# Altium project HFAC_Stimulator_4channel.PrjPCB (part 1 of 2)
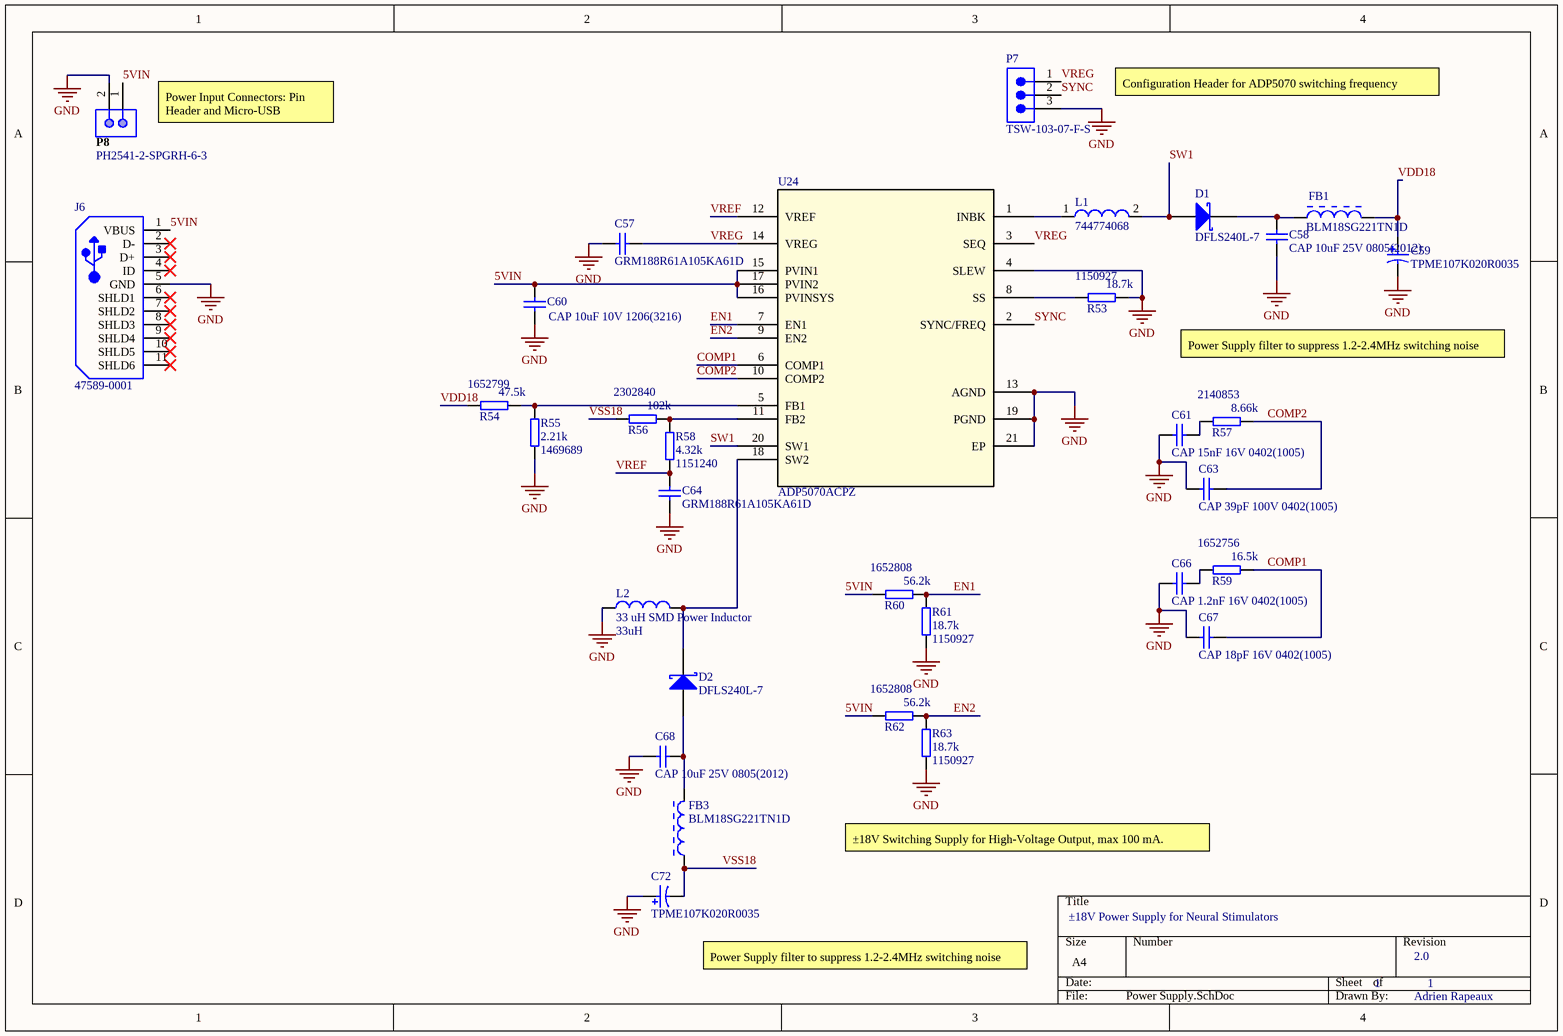
[diagram p0: Power Supply.SchDoc]
11 sheets, 198 parts. Net scope: global (net labels, ports and power ports of the same name join across sheets).
Board files: HFAC_Stimulator_4channel.PcbDoc, HFAC_Stimulator_4channel_panel.PcbDoc
Sheets:
  Power Supply.SchDoc
  Digital Interfaces.SchDoc
  Howland Channel 1.SchDoc
  Howland Channel 2.SchDoc
  Howland Channel 3.SchDoc
  Howland Channel 4.SchDoc
  Freedom Board Interface.SchDoc
  Isolated MCU Power Supply.SchDoc
  Low-Voltage Power Supply.SchDoc
  Electrode Monitor Channel.SchDoc
  N17V5 Reference.SchDoc

## Sheet Power Supply.SchDoc
size A4

### Parts
C57  GRM188R61A105KA61D  [CAPC1608X90X35LL10T15]
C58  CAP 10uF 25V 0805(2012)  [CAPC0805(2012)145_N]
C59  TPME107K020R0035  [CAPMP7344X31-T_V]
C60  CAP 10uF 10V 1206(3216)  [CAPC1206(3216)130_L]
C61  CAP 15nF 16V 0402(1005)  [CAPC0402(1005)60_L]
C63  CAP 39pF 100V 0402(1005)  [CAPC0402(1005)60_L]
C64  GRM188R61A105KA61D  [CAPC1608X90X35LL10T15]
C66  CAP 1.2nF 16V 0402(1005)  [CAPC0402(1005)60_L]
C67  CAP 18pF 16V 0402(1005)  [CAPC0402(1005)60_L]
C68  CAP 10uF 25V 0805(2012)  [CAPC0805(2012)145_N]
C72  TPME107K020R0035  [CAPMP7344X31-T_V]
D1  DFLS240L-7  [DIOD-POWERDI123-2_A_V]
D2  DFLS240L-7  [DIOD-POWERDI123-2_A_V]
FB1  BLM18SG221TN1D  [MURA-BLM18SG-B25-CHIP-2_V1]
FB3  BLM18SG221TN1D  [MURA-BLM18SG-B25-CHIP-2_V1]
J6  47589-0001  [MOLX-47589-0001_V]
L1  744774068  [WE-PD2-M]
L2  33 uH SMD Power Inductor  value 33uH  [LPS6235 SERIES]
P7  TSW-103-07-F-S  [SMTC-TSW-103-07-X-S]
P8  PH2541-2-SPGRH-6-3  [PH2541-2-SPGRH-6-3_V]
R53  18.7k  Supplier Part Number 2: 1150927  [RESC0402]
R54  47.5k  Supplier Part Number 2: 1652799  [RESC0402]
R55  2.21k  Supplier Part Number 1: 1469689  [RESC0402]
R56  102k  Supplier Part Number 1: 2302840  [RESC0402]
R57  8.66k  Supplier Part Number 1: 2140853  [RESC0402]
R58  4.32k  Supplier Part Number 1: 1151240  [RESC0402]
R59  16.5k  Supplier Part Number 1: 1652756  [RESC0402]
R60  56.2k  Supplier Part Number 1: 1652808  [RESC0402]
R61  18.7k  Supplier Part Number 2: 1150927  [RESC0402]
R62  56.2k  Supplier Part Number 1: 1652808  [RESC0402]
R63  18.7k  Supplier Part Number 2: 1150927  [RESC0402]
U24  ADP5070ACPZ  [CP_20_8]

### Nets
GND: C57.1 C58.1 C59.2 C60.1 C61.1 C63.1 C64.1 C66.1 C67.1 C68.1 C72.1 J6.5(GND) L2.1 P7.3 P8.2 R53.1 R55.2 R61.2 R63.2 U24.4(SLEW) U24.13(AGND) U24.19(PGND) U24.21(EP)
5VIN: C60.2 J6.1(VBUS) P8.1 R60.2 R62.2 U24.15(PVIN1) U24.16(PVINSYS) U24.17(PVIN2)
COMP1: C67.2 R59.1 U24.6(COMP1)
COMP2: C63.2 R57.1 U24.10(COMP2)
EN1: R60.1 R61.1 U24.7(EN1)
EN2: R62.1 R63.1 U24.9(EN2)
SW1: D1.1(A) L1.2 U24.20(SW1)
SYNC: P7.2 U24.2(SYNC/FREQ)
VDD18: C59.1 FB1.2 R54.2
VREF: C64.2 R58.2 U24.12(VREF)
VREG: C57.2 P7.1 U24.3(SEQ) U24.14(VREG)
VSS18: C72.2 FB3.1 R56.2
NetC58_2: C58.2 D1.2(K) FB1.1
NetC61_2: C61.2 R57.2
NetC66_2: C66.2 R59.2
NetC68_2: C68.2 D2.1(A) FB3.2
NetD2_2: D2.2(K) L2.2 U24.18(SW2)
NetL1_1: L1.1 U24.1(INBK)
NetR53_2: R53.2 U24.8(SS)
NetR54_1: R54.1 R55.1 U24.5(FB1)
NetR56_1: R56.1 R58.1 U24.11(FB2)

Not connected (* = marked no-connect by the designer): J6 2(D-)* 3(D+)* 4(ID)* 6(SHLD1)* 7(SHLD2)* 8(SHLD3)* 9(SHLD4)* 10(SHLD5)* 11(SHLD6)*

### Notes on the sheet
- Configuration Header for ADP5070 switching frequency
- (near P8) Power Input Connectors: Pin Header and Micro-USB
- Power Supply filter to suppress 1.2-2.4MHz switching noise
- ±18V Switching Supply for High-Voltage Output, max 100 mA.
- ±18V Power Supply for Neural Stimulators
- 1
- 2.0
- Adrien Rapeaux

### Library data of the parts
C57 C64 = CMP-2000-06336-1: Chip Capacitor, 1 uF, +/- 10%, 10 V, -55 to 85 degC, 0603 (1608 Metric), RoHS, Tape and Reel; Manufacturer: Murata; Dielectric: X5R; Voltage Rating: 10V; Case Height: 0.8mm; Temperature Coefficient / Code: +/-15%; Type: GeneralPurposeMLCC; Brand: MurataElectronics; Capacitance: 1uF; Case Length: 1.6mm; Capacitance - nF: 1000nF; Package Description: 2-Pin Surface Mount Device, Body 1.6 x 0.8 mm; Maximum Operating Temperature: +85C; Minimum Operating Temperature: -55C; Mounting Technology: SurfaceMount; RoHS: Details; Package Reference: 0603; Product: GeneralTypeMLCCs; Packaging: Reel; Case Code - mm: 1608; Manufacturer URL: http://www.murata.com/; Dimensions: 0.8mmWx1.6mmLx0.8mmH; Factory Pack Quantity: 4000; Case Code - in: 0603; Tolerance: 10%; Product Category: MultilayerCeramicCapacitorsMLCC-SMD/SMT; Series: GRM; Datasheet Version: 02/2016; Case Width: 0.8mm; Operating Temperature Range: -55Cto+85C; Datasheet URL: http://search.murata.co.jp/Ceramy/image/img/A01X/G101/ENG/GRM188R61A105KA61-01.pdf; Package / Case: 0603(1608metric); Termination Style: SMD/SMT; Voltage Rating DC: 10V
C58 C68 = CMP-1036-04932-1: CAP 10uF 25V ±10% 0805 (2012 Metric) Thickness 1.45mm SMD; Case-EIA: 0805; Case-Metric: 2012; Tolerance: Â±10%; Technology: SMT; Value: 10uF; Rated Voltage: 25 V; Max Thickness: 1.45 mm
C59 C72 = CMP-2000-07300-1: Low ESR, 100 uF, 25 V, +/- 10%, -55 to 125 degC, 2-Pin SMD, RoHS, Tape and Reel; Mfr Case Code: DCase; Manufacturer: AVX; ESR: 100mOhms; Unit Weight: 0.023634oz; Capacitance: 100uF; Voltage Rating: 10V; Tolerance: 20%; Leakage Current: 10uA; Ripple Current: 0.49mA; Qualification: Commercial; Dissipation Factor DF: 6; Product: TantalumSolidLowESRStandardGrade; Case Code - mm: 7343; Length: 7.3mm; Datasheet URL: http://datasheets.avx.com/TPS.pdf; Maximum Operating Temperature: +125C; Manufacturer URL: http://www.avx.com/; Package URL: http://www.avx.com/download/software/literature/AVX-Footprint-Library.pdf; Package / Case: 2917(7343metric); Series: TPS; Package Description: 2-Pin Surface Mount Device, Body 7.3 x 4.35 mm; Minimum Operating Temperature: -55C; Mounting Technology: SurfaceMount; Packaging: Reel; Datasheet Version: 01/2017; RoHS: True; Width: 4.3mm; Brand: AVX; Product Category: TantalumCapacitors-SolidSMD; Height: 3.1mm; Termination Style: SMD/SMT; Package Reference: CAPMP7344X31-T; Case Code - in: 2917; Operating Temperature Range: -55Cto+125C
C60 = CMP-1037-04970-1: CAP 10uF 10V -20% to +80% 1206 (3216 Metric) Thickness 1.3mm SMD; Case-Metric: 3216; Case-EIA: 1206; Value: 10uF; Rated Voltage: 10 V; Technology: SMT; Max Thickness: 1.3 mm; Tolerance: -20% to +80%
C61 = CMP-1034-01913-1: CAP 15nF 16V ±10% 0402 (1005 Metric) Thickness 0.6mm SMD; Case-Metric: 1005; Tolerance: Â±10%; Case-EIA: 0402; Value: 15nF; Rated Voltage: 16 V; Technology: SMT; Max Thickness: 0.6 mm
C63 = CMP-1034-01051-1: CAP 39pF 100V ±10% 0402 (1005 Metric) Thickness 0.6mm SMD; Case-Metric: 1005; Case-EIA: 0402; Tolerance: Â±10%; Technology: SMT; Max Thickness: 0.6 mm; Rated Voltage: 100 V; Value: 39pF
C66 = CMP-1034-01647-1: CAP 1.2nF 16V ±10% 0402 (1005 Metric) Thickness 0.6mm SMD; Case-EIA: 0402; Case-Metric: 1005; Tolerance: Â±10%; Value: 1.2nF; Rated Voltage: 16 V; Max Thickness: 0.6 mm; Technology: SMT
C67 = CMP-1034-00853-1: CAP 18pF 16V ±10% 0402 (1005 Metric) Thickness 0.6mm SMD; Case-Metric: 1005; Tolerance: Â±10%; Case-EIA: 0402; Max Thickness: 0.6 mm; Rated Voltage: 16 V; Value: 18pF; Technology: SMT
D1 D2 = CMP-2000-06158-1: Low VF Schottky Barrier Rectifier, 2 A, 40 V, -55 to 125 degC, 2-Pin SMD, RoHS, Tape and Reel; Manufacturer: Diodes Inc; Reverse Voltage-Max [Vrrm]: 40V; Forward Voltage: 0.5V; Average Rectified Current-Max: 2A; Peak Current-Max: 50A; Reverse Current-Max: 100µA; Mounting Technology: SurfaceMount; Package Description: 2-Pin Small Outline Diode, Body 2.8 x 1.78 mm; Manufacturer URL: http://www.diodes.com/; Datasheet URL: http://www.diodes.com/_files/datasheets/ds30516.pdf; Package Reference: POWERDI123-2_A; Datasheet Version: Rev. 8-2, 11/2009
FB1 FB3 = CMP-0686-00596-2: Chip Ferrite Bead for Power Lines (Low DC Resistance Type), 220 Ohm, 2500 mA, -55 to 125 degC, 1.6 x 0.8 x 0.65 mm SMD, Tape and Reel; Manufacturer: Murata; Impedance (at 100 MHz): 220 Ohm +/- 25%; DC Resistance: 0.040 Ohm Max.; Rated Current: 2500 mA; ComponentLink2Description: Datasheet; ComponentLink1Description: Manufacturer URL; ComponentLink3Description: Package Specification; DatasheetVersion: 08/2013; Packing: Tape and Reel; PackageReference: BLM18_H650-2; PackageDescription: 2-Pin Chip, Body 1.6 x 0.8 mm; Mounting Technology: Surface Mount; Operating Temperature Range: -55 to 125 degC; ComponentLink1URL: http://www.murata.com/; ComponentLink2URL: http://www.murata.com/products/catalog/pdf/c31e.pdf; ComponentLink3URL: http://www.murata.com/products/catalog/pdf/c31e.pdf; PartNumber: BLM18SG221TN1D
J6 = CMP-2000-05610-1: Right Angle Female Type AB Micro USB Connector, 30 V, 1.8 A, -30 to 85 degC, RoHS, Tape and Reel; Number of Ports: 1Port; Current Rating: 1.8A; Brand: Molex; Connector Type: MicroUSBTypeABreceptacle; Number of Contacts: 5Contact; Voltage Rating: 30VAC; Color: Black; Product: MicroUSBTypeABConnectors; Package URL: http://www.molex.com/pdm_docs/sd/475890001_sd.pdf; Contact Plating: Gold; Datasheet URL: http://www.molex.com/webdocs/datasheets/pdf/en-us/0475890001_IO_CONNECTORS.pdf; Operating Temperature Range: -20Cto+85C; Termination Style: SMD/SMT; Mounting Angle: Right; Package Reference: 47589-0001; Gender: Female; Package Description: Micro USB Connector, Pitch 0.65 mm, 5 Positions, Body 7.5 x 5.6 mm; Mounting Technology: SurfaceMount; Contact Material: CopperAlloy; Packaging: Reel; RoHS: True; Standard: USB; Manufacturer URL: http://www.molex.com/; Manufacturer: Molex; Datasheet Version: 12/2016; Product Category: USBConnectors; Series: 47589
L1 = CMP-0227-00446-1: SMD Power Inductor WE-PD2, L = 6.80 µH; Inductance: 6.80 ÂµH; ComponentLink1Description: Manufacturer Link; PackageVersion: 2005; ComponentLink1URL: http://www.we-online.com; ComponentLink2URL: http://www.we-online.de/katalog/media/pdf/744774068.pdf; PackageReference: WE-PD2-M; PackageDescription: SMD Inductor, 2-Leads, Body 5.8 x 5.2 mm; DatasheetVersion: ver 3, Jun-2006; ComponentLink2Description: Datasheet
L2 = LPS6235-333MRB: 33 uH SMD Power Inductor, 1A RMS, 1.4A Isat, Shielded, LPS6235 Series, Coilcraft; Published: 8-Jun-2000; LatestRevisionDate: 23 Nov 2018; LatestRevisionNote: N/A; PackageReference: LPS6235 SERIES; Publisher: Adrien Rapeaux; PackageDescription: 6mm x 6mm x 3.5mm; Code_JEITA: N/A; Code_IEC: N/A
P7 = CMP-1024-00331-1: 0.025" SQ Post Header, Through-hole, Vertical, -55 to 125 degC, 2.54 mm Pitch, 3-Pin, Male, RoHS; Manufacturer: Samtec; Pitch: 2.54 mm; DatasheetVersion: F-214; ComponentLink1Description: Manufacturer URL; ComponentLink3URL: http://www.samtec.com/documents/webfiles/cpdf/TSW-XXX-XX-XXX-X-XX-XXX-MKT.pdf; Mounting Technology: Through-hole; PackageDescription: .025[0.64] SQ. Post Terminal Strip Assembly; Temperature Range: -55 to 125 degC; ComponentLink3Description: Package Specification; Orientation: Vertical; PartNumber: TSW-103-07-F-S; RoHS: True; PackageVersion: DM, 8/1988; ComponentLink2Description: Datasheet; ComponentLink1URL: http://www.samtec.com; ComponentLink2URL: http://www.samtec.com/documents/webfiles/pdf/TSW_TH.PDF; PackageReference: TSW-103-07-X-S
P8 = CMP-0261-00001-1: Male Header, Pitch 2.54mm, 2x1 Position, Mated Height 6mm, Tail Length 3mm; PackageDescription: 2-Pin Male Header IDC, 2.54 x 5.08 mm Body, 2.54 mm Pitch; PartNumber: PH2541-2-SPGRH-6-3; ComponentLink1URL: http://www.suzhoupinchao.com/; Mounting Technology: Through Hole; ComponentLink1Description: Manufacturer URL; PackageReference: PH2541-2-SPGRH-6-3
R53 R61 R63 = myProto-12585: RES 18K7 0402 0.063W 1%; Part Number dvc: 12585; Manufacturer Part Number: CRCW040218K7FKTDBC; manufacturer: VISHAY; Prefered: Oui; device: Resistor; Part Number MyProto: myProto-12585; Category: Resistor; ComponentLink1Description: Manufacturer Link; ComponentLink1URL: http://www.vishay.com/; ComponentLink2Description: Datasheet; ComponentLink2URL: https://www.vishay.com/docs/20035/dcrcwe3.pdf; Pin Count: 2; Value: 18K7; casePackage: 0402; PowerRating: 0.063 W; Tolerance: 1%; Supplier 1: Farnell; Supplier 2: Farnell
R54 = myProto-12633: RES 47K5 0402 0.063W 1%; Part Number dvc: 12633; Manufacturer Part Number: CRCW040247K5FKTDBC; manufacturer: VISHAY; Prefered: Oui; device: Resistor; Part Number MyProto: myProto-12633; Category: Resistor; ComponentLink1Description: Manufacturer Link; ComponentLink1URL: http://www.vishay.com/; ComponentLink2Description: Datasheet; ComponentLink2URL: https://www.vishay.com/docs/20035/dcrcwe3.pdf; Pin Count: 2; Value: 47K5; casePackage: 0402; PowerRating: 0.063 W; Tolerance: 1%; Supplier 1: Farnell; Supplier 2: Farnell
R55 = myProto-12479: RES 2K21 0402 0.063W 1%; Part Number dvc: 12479; Manufacturer Part Number: CRCW04022K21FKTDBC; manufacturer: VISHAY; Prefered: Oui; device: Resistor; Part Number MyProto: myProto-12479; Category: Resistor; ComponentLink1Description: Manufacturer Link; ComponentLink1URL: http://www.vishay.com/; ComponentLink2Description: Datasheet; ComponentLink2URL: https://www.vishay.com/docs/20035/dcrcwe3.pdf; Pin Count: 2; Value: 2K21; casePackage: 0402; PowerRating: 0.063 W; Tolerance: 1%; Supplier 1: Farnell
R56 = myProto-12671: RES 102K 0402 0.063W 1%; Part Number dvc: 12671; Manufacturer Part Number: CRCW0402102KFKTDBC; manufacturer: VISHAY; Prefered: Oui; device: Resistor; Part Number MyProto: myProto-12671; Category: Resistor; ComponentLink1Description: Manufacturer Link; ComponentLink1URL: http://www.vishay.com/; ComponentLink2Description: Datasheet; ComponentLink2URL: https://www.vishay.com/docs/20035/dcrcwe3.pdf; Pin Count: 2; Value: 102K; casePackage: 0402; PowerRating: 0.063 W; Tolerance: 1%; Supplier 1: Farnell
R57 = myProto-12549: RES 8K66 0402 0.063W 1%; Part Number dvc: 12549; Manufacturer Part Number: CRCW04028K66FKTDBC; manufacturer: VISHAY; Prefered: Oui; device: Resistor; Part Number MyProto: myProto-12549; Category: Resistor; ComponentLink1Description: Manufacturer Link; ComponentLink1URL: http://www.vishay.com/; ComponentLink2Description: Datasheet; ComponentLink2URL: https://www.vishay.com/docs/20035/dcrcwe3.pdf; Pin Count: 2; Value: 8K66; casePackage: 0402; PowerRating: 0.063 W; Tolerance: 1%; Supplier 1: Farnell
R58 = myProto-12514: RES 4K32 0402 0.063W 1%; Part Number dvc: 12514; Manufacturer Part Number: CRCW04024K32FKTDBC; manufacturer: VISHAY; Prefered: Oui; device: Resistor; Part Number MyProto: myProto-12514; Category: Resistor; ComponentLink1Description: Manufacturer Link; ComponentLink1URL: http://www.vishay.com/; ComponentLink2Description: Datasheet; ComponentLink2URL: https://www.vishay.com/docs/20035/dcrcwe3.pdf; Pin Count: 2; Value: 4K32; casePackage: 0402; PowerRating: 0.063 W; Tolerance: 1%; Supplier 1: Farnell
R59 = myProto-12579: RES 16K5 0402 0.063W 1%; Part Number dvc: 12579; Manufacturer Part Number: CRCW040216K5FKTDBC; manufacturer: VISHAY; Prefered: Oui; device: Resistor; Part Number MyProto: myProto-12579; Category: Resistor; ComponentLink1Description: Manufacturer Link; ComponentLink1URL: http://www.vishay.com/; ComponentLink2Description: Datasheet; ComponentLink2URL: https://www.vishay.com/docs/20035/dcrcwe3.pdf; Pin Count: 2; Value: 16K5; casePackage: 0402; PowerRating: 0.063 W; Tolerance: 1%; Supplier 1: Farnell
R60 R62 = myProto-12642: RES 56K2 0402 0.063W 1%; Part Number dvc: 12642; Manufacturer Part Number: CRCW040256K2FKTDBC; manufacturer: VISHAY; Prefered: Oui; device: Resistor; Part Number MyProto: myProto-12642; Category: Resistor; ComponentLink1Description: Manufacturer Link; ComponentLink1URL: http://www.vishay.com/; ComponentLink2Description: Datasheet; ComponentLink2URL: https://www.vishay.com/docs/20035/dcrcwe3.pdf; Pin Count: 2; Value: 56K2; casePackage: 0402; PowerRating: 0.063 W; Tolerance: 1%; Supplier 1: Farnell
U24 = ADP5070ACPZ: Imported; RefDes: RefDes; Type: DEV; Value: Value

## Sheet Digital Interfaces.SchDoc
size A4
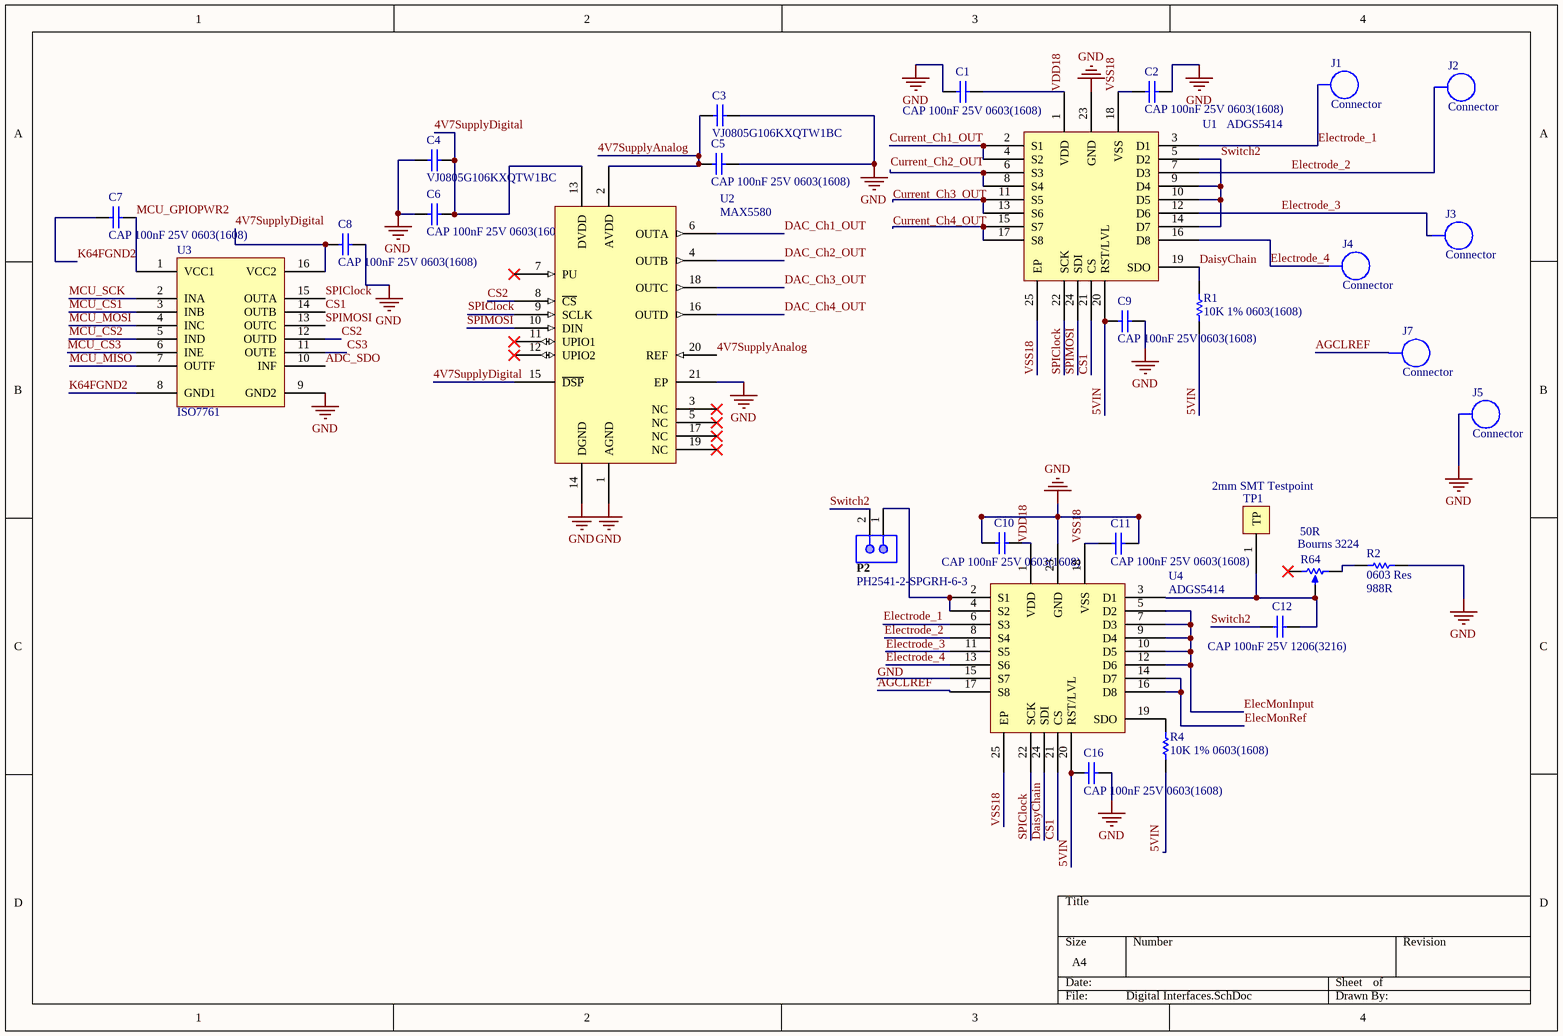
[diagram p1: Digital Interfaces.SchDoc]

### Parts
C1  CAP 100nF 25V 0603(1608)  [CAPC0603(1608)100_N]
C2  CAP 100nF 25V 0603(1608)  [CAPC0603(1608)100_N]
C3  VJ0805G106KXQTW1BC  [CAPC2013X145X50LL20T20]
C4  VJ0805G106KXQTW1BC  [CAPC2013X145X50LL20T20]
C5  CAP 100nF 25V 0603(1608)  [CAPC0603(1608)100_N]
C6  CAP 100nF 25V 0603(1608)  [CAPC0603(1608)100_N]
C7  CAP 100nF 25V 0603(1608)  [CAPC0603(1608)100_N]
C8  CAP 100nF 25V 0603(1608)  [CAPC0603(1608)100_N]
C9  CAP 100nF 25V 0603(1608)  [CAPC0603(1608)100_N]
C10  CAP 100nF 25V 0603(1608)  [CAPC0603(1608)100_N]
C11  CAP 100nF 25V 0603(1608)  [CAPC0603(1608)100_N]
C12  CAP 100nF 25V 1206(3216)  [CAPC1206(3216)190_M]
C16  CAP 100nF 25V 0603(1608)  [CAPC0603(1608)100_N]
J1  Connector  [Molex TermiMate Plug]
J2  Connector  [Molex TermiMate Plug]
J3  Connector  [Molex TermiMate Plug]
J4  Connector  [Molex TermiMate Plug]
J5  Connector  [Molex TermiMate Plug]
J7  Connector  [Molex TermiMate Plug]
P2  PH2541-2-SPGRH-6-3  [PH2541-2-SPGRH-6-3_V]
R1  10K 1% 0603(1608)  [RESC0603(1608)_N]
R2  0603 Res  value 988R  [J1-0603]
R4  10K 1% 0603(1608)  [RESC0603(1608)_N]
R64  Bourns 3224  value 50R  [BOURNS 3224W]
TP1  2mm SMT Testpoint  [Testpoint Harwin S1751]
U1  ADGS5414  [24LFCSP JEDEC MO-220-VGGD-8]
U2  MAX5580  [20TSSOP-EP U20E-1]
U3  ISO7761  [16SSOP JEDEC MO-137 AB]
U4  ADGS5414  [24LFCSP JEDEC MO-220-VGGD-8]

### Nets
GND: C1.1 C2.1 C3.2 C4.1 C5.1 C6.2 C8.1 C9.1 C10.1 C11.1 C16.1 J5.1 R2.1 U1.23(GND) U2.1(AGND) U2.14(DGND) U2.21(EP) U3.9(GND2) U4.15(S7) U4.23(GND)
4V7SupplyAnalog: C3.1 C5.2 U2.2(AVDD) U2.20(REF)
4V7SupplyDigital: C4.2 C6.1 C8.2 U2.13(DVDD) U2.15(~{DSP}) U3.16(VCC2)
5VIN: C9.2 C16.2 R1.1 R4.1 U1.20(RST/LVL) U4.20(RST/LVL)
ADC_SDO: U3.10(INF)
AGCLREF: J7.1 U4.17(S8)
CS1: U1.21(CS) U3.14(OUTB) U4.21(CS)
CS2: U2.8(~{CS}) U3.12(OUTD)
CS3: U3.11(OUTE)
Current_Ch1_OUT: U1.2(S1) U1.4(S2)
Current_Ch2_OUT: U1.6(S3) U1.8(S4)
Current_Ch3_OUT: U1.11(S5) U1.13(S6)
Current_Ch4_OUT: U1.15(S7) U1.17(S8)
DAC_Ch1_OUT: U2.6(OUTA)
DAC_Ch2_OUT: U2.4(OUTB)
DAC_Ch3_OUT: U2.18(OUTC)
DAC_Ch4_OUT: U2.16(OUTD)
DaisyChain: R1.2 U1.19(SDO) U4.24(SDI)
ElecMonInput: U4.5(D2) U4.7(D3) U4.9(D4) U4.10(D5) U4.12(D6)
ElecMonRef: U4.14(D7) U4.16(D8)
Electrode_1: J1.1 U1.3(D1) U4.6(S3)
Electrode_2: J2.1 U1.7(D3) U4.8(S4)
Electrode_3: J3.1 U1.12(D6) U4.11(S5)
Electrode_4: J4.1 U1.16(D8) U4.13(S6)
K64FGND2: C7.2 U3.8(GND1)
MCU_CS1: U3.3(INB)
MCU_CS2: U3.5(IND)
MCU_CS3: U3.6(INE)
MCU_GPIOPWR2: C7.1 U3.1(VCC1)
MCU_MISO: U3.7(OUTF)
MCU_MOSI: U3.4(INC)
MCU_SCK: U3.2(INA)
SPIClock: U1.22(SCK) U2.9(SCLK) U3.15(OUTA) U4.22(SCK)
SPIMOSI: U1.24(SDI) U2.10(DIN) U3.13(OUTC)
Switch2: C12.1 P2.2 U1.5(D2) U1.9(D4) U1.10(D5) U1.14(D7)
VDD18: C1.2 C10.2 U1.1(VDD) U4.1(VDD)
VSS18: C2.2 C11.2 U1.18(VSS) U1.25(EP) U4.18(VSS) U4.25(EP)
NetC12_2: C12.2 R64.2(TAP) TP1.1(TP) U4.3(D1)
NetP2_1: P2.1 U4.2(S1) U4.4(S2)
NetR2_2: R2.2 R64.3(BOT)
NetR4_2: R4.2 U4.19(SDO)

Not connected (* = marked no-connect by the designer): R64 1(TOP)*; U2 3(NC)* 5(NC)* 7(PU)* 11(UPIO1)* 12(UPIO2)* 17(NC)* 19(NC)*

### Library data of the parts
C1 C2 C5-C11 C16 = CMP-1035-02589-1: CAP 100nF 25V ±20% 0603 (1608 Metric) Thickness 1mm SMD; Case-EIA: 0603; Tolerance: Â±20%; Case-Metric: 1608; Value: 100nF; Max Thickness: 1 mm; Technology: SMT; Rated Voltage: 25 V
C3 C4 = CMP-2000-07390-1: Chip Capacitor, 10 uF, +/- 10%, 10 V, -55 to 85 degC, 0805 (2012 Metric), RoHS, Tape and Reel; Manufacturer: Vishay; Capacitance: 10uF; Unit Weight: 0.000194oz; Voltage Rating DC: 10VDC; Brand: Vishay/Vitramon; Dielectric: X5R; Series: VJW1BC; Mounting Technology: SurfaceMount; Case Code - in: 0805; Package Description: 2-Pin Surface Mount Device, Body 2.00 x 1.25 mm; Case Code - mm: 2012; Length: 2mm; Datasheet Version: 07/2016; Manufacturer URL: http://www.vishay.com/; Product Category: MultilayerCeramicCapacitorsMLCC-SMD/SMT; Maximum Operating Temperature: +85C; Datasheet URL: http://www.vishay.com/docs/28548/vjw1bcbascomseries.pdf; Factory Pack Quantity: 3000; Termination Style: SMD/SMT; Package / Case: 0805(2012metric); Minimum Operating Temperature: -55C; Package Reference: 0805; RoHS: True; Width: 1.25mm; Height: 1.25mm; Tolerance: 10%; Packaging: Reel
C12 = CMP-1037-04189-1: CAP 100nF 25V ±5% 1206 (3216 Metric) Thickness 1.9mm SMD; Case-Metric: 3216; Case-EIA: 1206; Tolerance: Â±5%; Rated Voltage: 25 V; Technology: SMT; Max Thickness: 1.9 mm; Value: 100nF
J1-J5 J7 = Molex TermiMate: Molex TermiMate Plug/Receptacle, 1-way SMD Board to Board or Wire to Board Connector
P2 = CMP-0261-00001-1: as P8 on sheet Power Supply; PackageDescription: 2-Pin Male Header IDC, 2.54 x 5.08 mm Body, 2.54 mm Pitch; PartNumber: PH2541-2-SPGRH-6-3; ComponentLink1URL: http://www.suzhoupinchao.com/; Mounting Technology: Through Hole; ComponentLink1Description: Manufacturer URL; PackageReference: PH2541-2-SPGRH-6-3
R1 R4 = CMP-1012-00623-1: 10K 0.1W 1% 0603 (1608 Metric)  SMD; Value: 10000.00 Ohm; Case-EIA: 0603; Case-Metric: 1608; Power: 0.1 W; Tolerance: 1 %; Technology: SMT
R2 = Res1: Chip Resistor, 0603, 1%; Published: 8-Jun-2000; LatestRevisionDate: 17-Jul-2002; LatestRevisionNote: Re-released for DXP Platform.; PackageReference: AXIAL-0.3; Publisher: Altium Limited; PackageDescription: Axial Device, Thru-Hole; 2 Leads; 0.3 in Pin Spacing
R64 = 3224-Series Trimmer Potentiometer: Trimmer Potentiometer, Cermet, 3224-Series (Bourns); Sim Note: Enter the Resistance value and the set point into parameter fields.; Set Position: 0.5; Published: 8-Jun-2000; LatestRevisionDate: 17-Jul-2002; LatestRevisionNote: Re-released for DXP Platform.; PackageReference: VR5; Publisher: Altium Limited; PackageDescription: Variable Resistor, Thru-Hole; 3 Leads
TP1 = TestPoint SMT Harwin S1751: SMT Testpoint, 2mm height, Harwin S1751
U1 U4 = ADGS5414: Octal ±20V SPST Switches, SPI interface, 13.5 ohm Ron, Break before Make
U2 = MAX5580: 12-Bit Voltage DAC, 5.25V Single Supply, Buffered Fast-Settling, SPI input, Daisy Chainable
U3 = ISO7761: Capacitive Digital Isolator, 5 forward channels 1 reverse channel, failsafe high, 100 Mbps, 2.25-5.5V

## Sheet Howland Channel 1.SchDoc
size A4
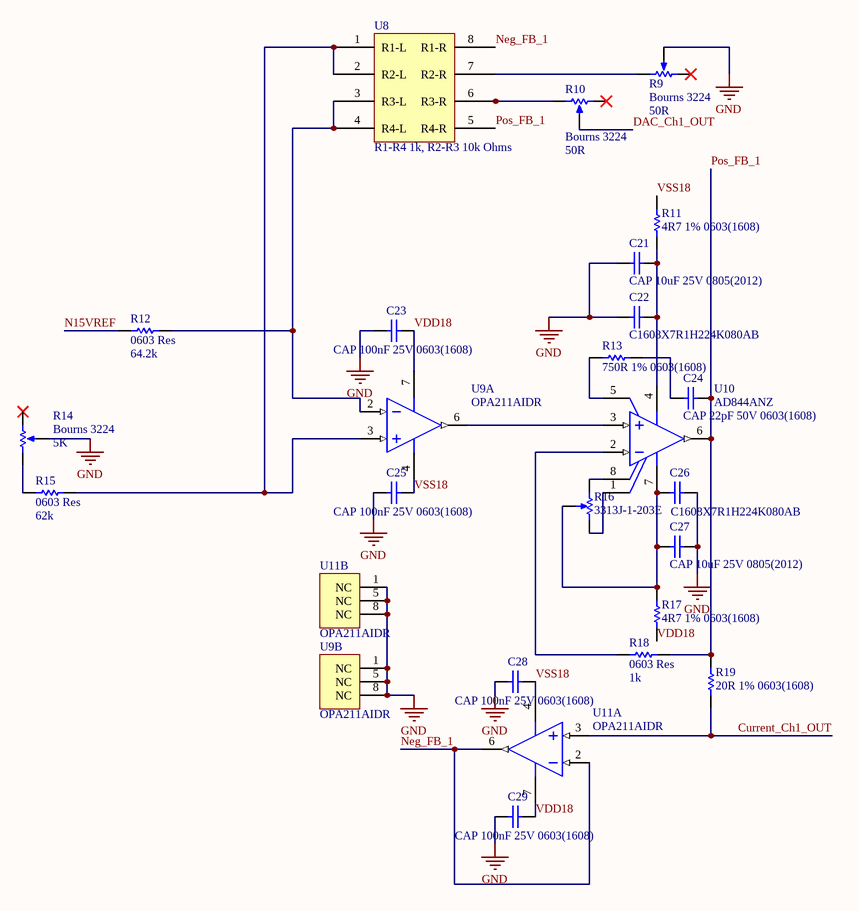
[diagram p2: Howland Channel 1.SchDoc]

### Parts
C21  CAP 10uF 25V 0805(2012)  [CAPC0805(2012)145_N]
C22  C1608X7R1H224K080AB  [TDK-C1608-2_A_M]
C23  CAP 100nF 25V 0603(1608)  [CAPC0603(1608)100_N]
C24  CAP 22pF 50V 0603(1608)  [CAPC0603(1608)100_M]
C25  CAP 100nF 25V 0603(1608)  [CAPC0603(1608)100_N]
C26  C1608X7R1H224K080AB  [TDK-C1608-2_A_M]
C27  CAP 10uF 25V 0805(2012)  [CAPC0805(2012)145_N]
C28  CAP 100nF 25V 0603(1608)  [CAPC0603(1608)100_N]
C29  CAP 100nF 25V 0603(1608)  [CAPC0603(1608)100_N]
R9  Bourns 3224  value 50R  [BOURNS 3224W]
R10  Bourns 3224  value 50R  [BOURNS 3224W]
R11  4R7 1% 0603(1608)  [RESC0603(1608)_M]
R12  0603 Res  value 64.2k  [J1-0603]
R13  750R 1% 0603(1608)  [RESC0603(1608)_L]
R14  Bourns 3224  value 5K  [BOURNS 3224W]
R15  0603 Res  value 62k  [J1-0603]
R16  3313J-1-203E  [BOUR-3313J-1_V]
R17  4R7 1% 0603(1608)  [RESC0603(1608)_M]
R18  0603 Res  value 1k  [J1-0603]
R19  20R 1% 0603(1608)  [RESC0603(1608)_M]
U8  R1-R4 1k, R2-R3 10k Ohms  [0612 (4x0603)]
U9  OPA211AIDR  [TI-D8_L]  (parts A,B of 2)
U10  AD844ANZ  [ADI-N-8]
U11  OPA211AIDR  [TI-D8_L]  (parts A,B of 2)

### Nets
GND: C21.1 C22.1 C23.1 C25.1 C26.2 C27.2 C28.1 C29.1 R9.2(TAP) R14.2(TAP) U9.1(NC) U9.5(NC) U9.8(NC) U11.1(NC) U11.5(NC) U11.8(NC)
Current_Ch1_OUT: R19.1 U11.3(IN+)
DAC_Ch1_OUT: R10.2(TAP)
N15VREF: R12.2
Neg_FB_1: U8.8(R1-R) U11.2(IN-) U11.6(OUT)
Pos_FB_1: C24.2 R18.1 R19.2 U8.5(R4-R) U10.6(OUTPUT)
VDD18: C23.2 C29.2 R17.1 U9.7(V+) U11.7(V+)
VSS18: C25.2 C28.2 R11.2 U9.4(V-) U11.4(V-)
NetC21_2: C21.2 C22.2 R11.1 U10.4(-VS)
NetC24_1: C24.1 R13.2
NetC26_1: C26.1 C27.1 R16.2 R17.2 U10.7(+VS)
NetR9_3: R9.3(BOT) U8.7(R2-R)
NetR10_1: R10.1(TOP) U8.6(R3-R)
NetR12_1: R12.1 U8.3(R3-L) U8.4(R4-L) U9.2(IN-)
NetR13_1: R13.1 U10.5(TZ)
NetR14_1: R14.1(TOP) R15.2
NetR15_1: R15.1 U8.1(R1-L) U8.2(R2-L) U9.3(IN+)
NetR16_1: R16.1 U10.8(NULL)
NetR16_3: R16.3 U10.1(NULL)
NetR18_2: R18.2 U10.2(-IN)
NetU9_6: U9.6(OUT) U10.3(+IN)

Not connected (* = marked no-connect by the designer): R9 1(TOP)*; R10 3(BOT)*; R14 3(BOT)*

### Library data of the parts
C21 C27 = CMP-1036-04932-1: as C58 on sheet Power Supply; Technology: SMT; Value: 10uF; Rated Voltage: 25 V; Max Thickness: 1.45 mm
C22 C26 = CMP-2000-05394-1: Cap Ceramic, 0.22 uF, +/- 10%, -55 to 125 degC, 2-Pin SMD (0603), RoHS, Tape and Reel; Manufacturer: TDK; PCN Part Number: MLCCPartNumberChange30/Nov/2012; Capacitance: 0.22µF; Other Names: 445-7408-1; Design Resources: 20WNon-IsolatedBuckLEDDriverUsingPLLNK460KG; Online Catalog: CSeries,GeneralPurpose; Kits: 445-9014-KIT-ND-KITMLCC100PF-22UF060310-50V445-9003-KIT-ND-KITCAPCERHICAPMLCCSMD445-173086-KIT-ND-C0402-2220X7R6.3-50V1,000PF-; Temperature Coefficient: X7R; Product Training Modules: CSeriesGeneralApplicationsSEAT,CCV,andTVCLDesignToolsGuidetoReplacinganElectrolyticCapacitorwithanMLCC; Voltage - Rated: 50V; Ratings: -; Lead Spacing: -; Package Description: 2-Pin Chip Capacitor, Body 1.7 x 0.9 mm; Datasheet URL: https://datasheet.ciiva.com/24218/c1608x7r1h224k080ab-264841-24218813.pdf; Applications: GeneralPurpose; Series: C; Manufacturer URL: http://www.tdk.com/; Features: -; Tolerance: ±10%; Package Reference: 603; Family: CeramicCapacitors; Standard Package: 1; RoHS Information: RoHSCertificate-MLCC; Package / Case: 0603(1608Metric); Operating Temperature: -55degC~125degC; Datasheet Version: Sep-13; Mounting Type: SurfaceMount,MLCC; Lead Style: -; Height - Seated (Max): -; Packaging: CutTape(CT); Category: Capacitors
C23 C25 C28 C29 = CMP-1035-02589-1: as C1 on sheet Digital Interfaces; Value: 100nF; Max Thickness: 1 mm; Technology: SMT; Rated Voltage: 25 V
C24 = CMP-1035-00820-1: CAP 22pF 50V ±2% 0603 (1608 Metric) Thickness 1mm SMD; Case-Metric: 1608; Case-EIA: 0603; Tolerance: Â±2%; Rated Voltage: 50 V; Value: 22pF; Technology: SMT; Max Thickness: 1 mm
R9 R10 R14 = 3224-Series Trimmer Potentiometer: as R64 on sheet Digital Interfaces; Published: 8-Jun-2000; LatestRevisionDate: 17-Jul-2002; LatestRevisionNote: Re-released for DXP Platform.; PackageReference: VR5; Publisher: Altium Limited; PackageDescription: Variable Resistor, Thru-Hole; 3 Leads
R11 R17 = CMP-1012-00247-1: 4R7 0.1W 1% 0603 (1608 Metric)  SMD; Case-EIA: 0603; Case-Metric: 1608; Value: 4.70 Ohm; Power: 0.1 W; Technology: SMT; Tolerance: 1 %
R12 R15 R18 = Res1: Chip Resistor, 0603, 1%; Published: 8-Jun-2000; LatestRevisionDate: 17-Jul-2002; LatestRevisionNote: Re-released for DXP Platform.; PackageReference: AXIAL-0.3; Publisher: Altium Limited; PackageDescription: Axial Device, Thru-Hole; 2 Leads; 0.3 in Pin Spacing
R13 = CMP-1012-00496-1: 750R 0.1W 1% 0603 (1608 Metric)  SMD; Value: 750.00 Ohm; Case-Metric: 1608; Case-EIA: 0603; Technology: SMT; Tolerance: 1 %; Power: 0.1 W
R16 = CMP-2000-05586-1: 3 mm Trimpot(R) Trimming Potentiometer, 20 KOhm, +/- 20%, 0.125 W, -55 to 125 degC, 3-Pin SMD, RoHS, Tape and Reel; Manufacturer: Bourns; Insulation Resistance: 100Megohms(Min.)@500VDC; Rotational Life: 100Cycles; Resolution: Infinite; Brand/Series: Trimpot®3313-SealedSeries; Temperature, Operating, Maximum: +125°C; Resistance: 20Kilohms; Resistance, Insulation: 100Megohms; Material, Element: Cermet; Standards: RoHSCompliant; Dielectric Strength: 500VAC; Load Life: 1000hr@0.125W,70°C; Torque: 50g-cm; Temperature Coefficient: ±100ppm/°C; Number of Turns: 1; Power, Rating: 0.125W; Angle, Mechanical: 250°; Temperature, Operating, Minimum: -55°C; Package Reference: 3313J-1; Tolerance: ±20%; Type: Trimmer; Package Description: 3-Pin Surface Mount Device, Body 3.5 x 3.2 mm, Pitch 1.15 mm; Mounting Technology: SurfaceMount; Datasheet URL: http://www.bourns.com/docs/Product-Datasheets/3313.pdf; Mounting Type: SurfaceMount; Manufacturer URL: http://www.bourns.com/; Datasheet Version: 05/2016; Termination: SMD
R19 = CMP-1012-00316-1: 20R 0.1W 1% 0603 (1608 Metric)  SMD; Case-EIA: 0603; Case-Metric: 1608; Value: 20.00 Ohm; Technology: SMT; Tolerance: 1 %; Power: 0.1 W
U8 = VISHAY ACAS: Matched Resistor Network, Isolated, multi-0603 package, Abs Tol 0.1%, Rel Tol 0.05%
U9 U11 = CMP-0272-00537-2: 1.1 nV/rtHz Noise, Low Power, Precision Operational Amplifier, 4.5 to 36 V, -40 to 125 degC, 8-pin SOIC (D8), Green (RoHS & no Sb/Br); Manufacturer: Texas Instruments; Total Supply Voltage(Min)(+5V is 5, +/-5V is 10): 4.5; Number of Channels: 1; Offset Drift(Typ)(uV/C): 0.15; GBW(Typ)(MHz): 45; Slew Rate(Typ)(V/us): 27; Sub Family: High Supply Voltage Amplifier (>=30V), Low Noise Amp (<=10nV/rtHz), Low Offset Voltage Amplifier (<=500uV), Precision Amplifier; Rating: Catalog; IIB(Max)(pA): 175000; Vio (25C)(Max)(mV): 0.125; Packing: LARGE T&R; Total Supply Voltage(Max)(+5V is 5, +/-5V is 10): 36; CMRR(Min)(dB): 114; Eco-Plan: Green (RoHS & no Sb/Br); DatasheetVersion: SBOS377G; Iq per channel(Max)(mA): 4.5; ComponentLink2URL: http://www.ti.com/lit/ds/symlink/opa211.pdf; ComponentLink1Description: Manufacturer URL; ComponentLink3Description: Package Specification; Code_JEDEC: MS-012; ComponentLink3URL: http://www.ti.com/litv/pdf/msoi002j; PartNumber: OPA211AIDR; ComponentLink2Description: Datasheet; PackageReference: D8; PackageVersion: 4040047-3/M, 06/2011; ComponentLink1URL: http://www.ti.com/; Mounting Technology: Surface Mount; PackageDescription: 8-Pin Plastic Small Outline, Body 4.9 x 3.9 mm, Pitch 1.27 mm; PartId: 1
U10 = CMP-0384-00240-1: Single Channel Wide Bandwidth Operational Amplifier, 60 MHz BW, 2 KV/us SR, Industrial, 8-pin DIP (N-8), Tube; Generic Part Number: AD844; Manufacturer: Analog Devices; Amplifiers Per Package: 1; Small Signal Bandwidth: 60MHz; Iq/Amp: 6.5mA; V Span Max: 36V; V Span Min: 9V; Slew Rate: 2KV/us; Input Bias Current: 150nA; Input Offset Voltage: 50uV; Code_JEDEC: MS-001; PackageDescription: 8-Pin Plastic Dual In-Line Package, Row spacing 7.62 mm, Pitch 2.54 mm; DatasheetVersion: Rev. F; ComponentLink2URL: http://www.analog.com/static/imported-files/data_sheets/AD844.pdf; PackageReference: N-8; ComponentLink2Description: Datasheet; PartNumber: AD844ANZ; ComponentLink1URL: http://www.analog.com/en/index.html; ComponentLink3Description: Package Specification; Mounting Technology: Through Hole; ComponentLink3URL: http:/www.analog.com/static/imported-files/packages/PKG_PDF/PDIP(N)/N_8.pdf; ComponentLink1Description: Manufacturer URL; PackageVersion: 070606-A; Packing: Tube

## Sheet Howland Channel 2.SchDoc
size A4
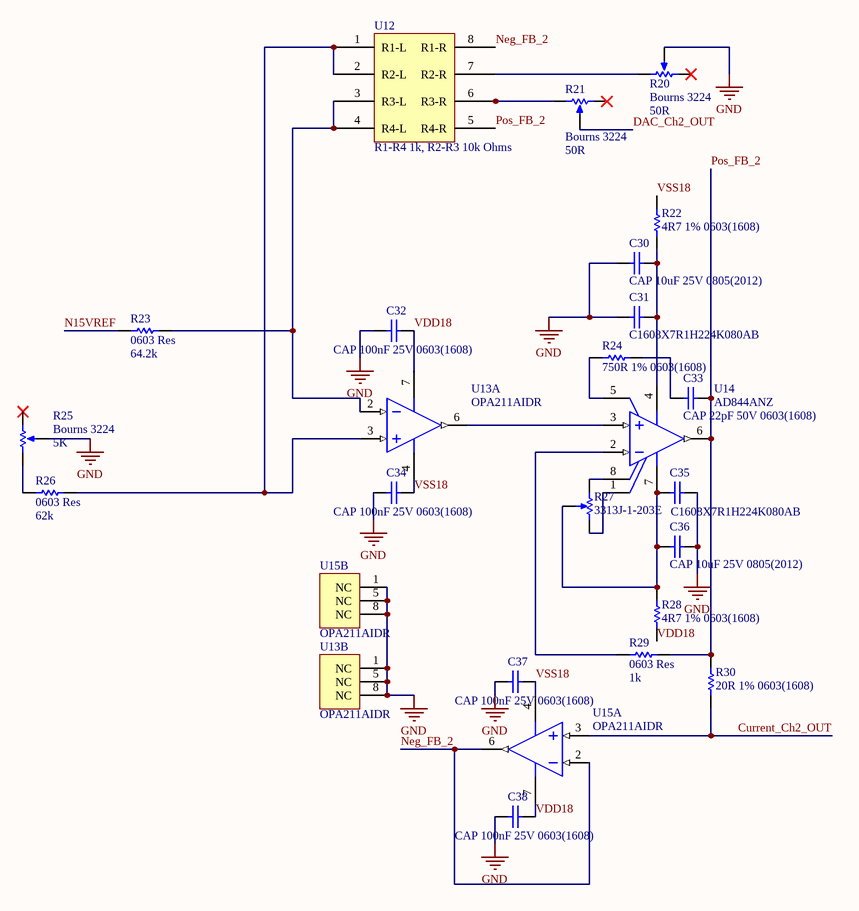
[diagram p3: Howland Channel 2.SchDoc]

### Parts
C30  CAP 10uF 25V 0805(2012)  [CAPC0805(2012)145_N]
C31  C1608X7R1H224K080AB  [TDK-C1608-2_A_M]
C32  CAP 100nF 25V 0603(1608)  [CAPC0603(1608)100_N]
C33  CAP 22pF 50V 0603(1608)  [CAPC0603(1608)100_M]
C34  CAP 100nF 25V 0603(1608)  [CAPC0603(1608)100_N]
C35  C1608X7R1H224K080AB  [TDK-C1608-2_A_M]
C36  CAP 10uF 25V 0805(2012)  [CAPC0805(2012)145_N]
C37  CAP 100nF 25V 0603(1608)  [CAPC0603(1608)100_N]
C38  CAP 100nF 25V 0603(1608)  [CAPC0603(1608)100_N]
R20  Bourns 3224  value 50R  [BOURNS 3224W]
R21  Bourns 3224  value 50R  [BOURNS 3224W]
R22  4R7 1% 0603(1608)  [RESC0603(1608)_M]
R23  0603 Res  value 64.2k  [J1-0603]
R24  750R 1% 0603(1608)  [RESC0603(1608)_L]
R25  Bourns 3224  value 5K  [BOURNS 3224W]
R26  0603 Res  value 62k  [J1-0603]
R27  3313J-1-203E  [BOUR-3313J-1_V]
R28  4R7 1% 0603(1608)  [RESC0603(1608)_M]
R29  0603 Res  value 1k  [J1-0603]
R30  20R 1% 0603(1608)  [RESC0603(1608)_M]
U12  R1-R4 1k, R2-R3 10k Ohms  [0612 (4x0603)]
U13  OPA211AIDR  [TI-D8_L]  (parts A,B of 2)
U14  AD844ANZ  [ADI-N-8]
U15  OPA211AIDR  [TI-D8_L]  (parts A,B of 2)

### Nets
GND: C30.1 C31.1 C32.1 C34.1 C35.2 C36.2 C37.1 C38.1 R20.2(TAP) R25.2(TAP) U13.1(NC) U13.5(NC) U13.8(NC) U15.1(NC) U15.5(NC) U15.8(NC)
Current_Ch2_OUT: R30.1 U15.3(IN+)
DAC_Ch2_OUT: R21.2(TAP)
N15VREF: R23.2
Neg_FB_2: U12.8(R1-R) U15.2(IN-) U15.6(OUT)
Pos_FB_2: C33.2 R29.1 R30.2 U12.5(R4-R) U14.6(OUTPUT)
VDD18: C32.2 C38.2 R28.1 U13.7(V+) U15.7(V+)
VSS18: C34.2 C37.2 R22.2 U13.4(V-) U15.4(V-)
NetC30_2: C30.2 C31.2 R22.1 U14.4(-VS)
NetC33_1: C33.1 R24.2
NetC35_1: C35.1 C36.1 R27.2 R28.2 U14.7(+VS)
NetR20_3: R20.3(BOT) U12.7(R2-R)
NetR21_1: R21.1(TOP) U12.6(R3-R)
NetR23_1: R23.1 U12.3(R3-L) U12.4(R4-L) U13.2(IN-)
NetR24_1: R24.1 U14.5(TZ)
NetR25_1: R25.1(TOP) R26.2
NetR26_1: R26.1 U12.1(R1-L) U12.2(R2-L) U13.3(IN+)
NetR27_1: R27.1 U14.8(NULL)
NetR27_3: R27.3 U14.1(NULL)
NetR29_2: R29.2 U14.2(-IN)
NetU13_6: U13.6(OUT) U14.3(+IN)

Not connected (* = marked no-connect by the designer): R20 1(TOP)*; R21 3(BOT)*; R25 3(BOT)*

### Library data of the parts
C30 C36 = CMP-1036-04932-1: as C58 on sheet Power Supply; Technology: SMT; Value: 10uF; Rated Voltage: 25 V; Max Thickness: 1.45 mm
C31 C35 = CMP-2000-05394-1: as C22 on sheet Howland Channel 1; Ratings: -; Lead Spacing: -; Package Description: 2-Pin Chip Capacitor, Body 1.7 x 0.9 mm; Datasheet URL: https://datasheet.ciiva.com/24218/c1608x7r1h224k080ab-264841-24218813.pdf; Applications: GeneralPurpose; Series: C; Manufacturer URL: http://www.tdk.com/; Features: -; Tolerance: ±10%; Package Reference: 603; Family: CeramicCapacitors; Standard Package: 1; RoHS Information: RoHSCertificate-MLCC; Package / Case: 0603(1608Metric); Operating Temperature: -55degC~125degC; Datasheet Version: Sep-13; Mounting Type: SurfaceMount,MLCC; Lead Style: -; Height - Seated (Max): -; Packaging: CutTape(CT); Category: Capacitors
C32 C34 C37 C38 = CMP-1035-02589-1: as C1 on sheet Digital Interfaces; Value: 100nF; Max Thickness: 1 mm; Technology: SMT; Rated Voltage: 25 V
C33 = CMP-1035-00820-1: as C24 on sheet Howland Channel 1; Rated Voltage: 50 V; Value: 22pF; Technology: SMT; Max Thickness: 1 mm
R20 R21 R25 = 3224-Series Trimmer Potentiometer: as R64 on sheet Digital Interfaces; Published: 8-Jun-2000; LatestRevisionDate: 17-Jul-2002; LatestRevisionNote: Re-released for DXP Platform.; PackageReference: VR5; Publisher: Altium Limited; PackageDescription: Variable Resistor, Thru-Hole; 3 Leads
R22 R28 = CMP-1012-00247-1: as R11 on sheet Howland Channel 1; Power: 0.1 W; Technology: SMT; Tolerance: 1 %
R23 R26 R29 = Res1: Chip Resistor, 0603, 1%; Published: 8-Jun-2000; LatestRevisionDate: 17-Jul-2002; LatestRevisionNote: Re-released for DXP Platform.; PackageReference: AXIAL-0.3; Publisher: Altium Limited; PackageDescription: Axial Device, Thru-Hole; 2 Leads; 0.3 in Pin Spacing
R24 = CMP-1012-00496-1: as R13 on sheet Howland Channel 1; Technology: SMT; Tolerance: 1 %; Power: 0.1 W
R27 = CMP-2000-05586-1: as R16 on sheet Howland Channel 1; Package Reference: 3313J-1; Tolerance: ±20%; Type: Trimmer; Package Description: 3-Pin Surface Mount Device, Body 3.5 x 3.2 mm, Pitch 1.15 mm; Mounting Technology: SurfaceMount; Datasheet URL: http://www.bourns.com/docs/Product-Datasheets/3313.pdf; Mounting Type: SurfaceMount; Manufacturer URL: http://www.bourns.com/; Datasheet Version: 05/2016; Termination: SMD
R30 = CMP-1012-00316-1: as R19 on sheet Howland Channel 1; Technology: SMT; Tolerance: 1 %; Power: 0.1 W
U12 = VISHAY ACAS: as U8 on sheet Howland Channel 1
U13 U15 = CMP-0272-00537-2: as U9 on sheet Howland Channel 1; Eco-Plan: Green (RoHS & no Sb/Br); DatasheetVersion: SBOS377G; Iq per channel(Max)(mA): 4.5; ComponentLink2URL: http://www.ti.com/lit/ds/symlink/opa211.pdf; ComponentLink1Description: Manufacturer URL; ComponentLink3Description: Package Specification; Code_JEDEC: MS-012; ComponentLink3URL: http://www.ti.com/litv/pdf/msoi002j; PartNumber: OPA211AIDR; ComponentLink2Description: Datasheet; PackageReference: D8; PackageVersion: 4040047-3/M, 06/2011; ComponentLink1URL: http://www.ti.com/; Mounting Technology: Surface Mount; PackageDescription: 8-Pin Plastic Small Outline, Body 4.9 x 3.9 mm, Pitch 1.27 mm; PartId: 1
U14 = CMP-0384-00240-1: as U10 on sheet Howland Channel 1; Code_JEDEC: MS-001; PackageDescription: 8-Pin Plastic Dual In-Line Package, Row spacing 7.62 mm, Pitch 2.54 mm; DatasheetVersion: Rev. F; ComponentLink2URL: http://www.analog.com/static/imported-files/data_sheets/AD844.pdf; PackageReference: N-8; ComponentLink2Description: Datasheet; PartNumber: AD844ANZ; ComponentLink1URL: http://www.analog.com/en/index.html; ComponentLink3Description: Package Specification; Mounting Technology: Through Hole; ComponentLink3URL: http:/www.analog.com/static/imported-files/packages/PKG_PDF/PDIP(N)/N_8.pdf; ComponentLink1Description: Manufacturer URL; PackageVersion: 070606-A; Packing: Tube

## Sheet Howland Channel 3.SchDoc
size A4
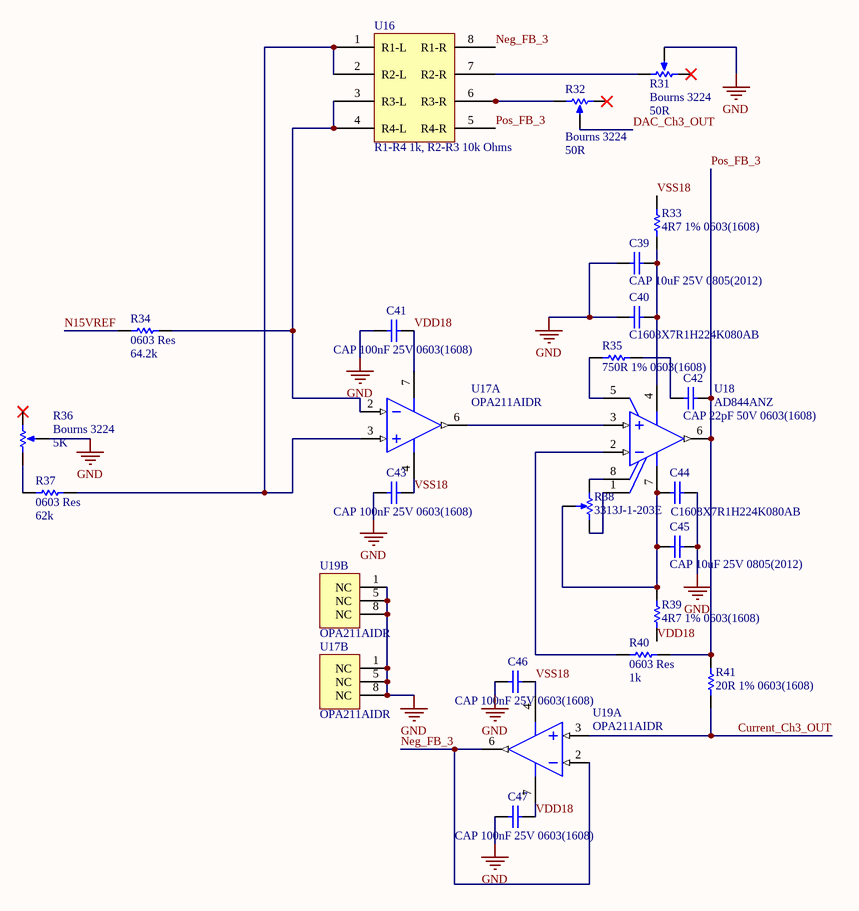
[diagram p4: Howland Channel 3.SchDoc]

### Parts
C39  CAP 10uF 25V 0805(2012)  [CAPC0805(2012)145_N]
C40  C1608X7R1H224K080AB  [TDK-C1608-2_A_M]
C41  CAP 100nF 25V 0603(1608)  [CAPC0603(1608)100_N]
C42  CAP 22pF 50V 0603(1608)  [CAPC0603(1608)100_M]
C43  CAP 100nF 25V 0603(1608)  [CAPC0603(1608)100_N]
C44  C1608X7R1H224K080AB  [TDK-C1608-2_A_M]
C45  CAP 10uF 25V 0805(2012)  [CAPC0805(2012)145_N]
C46  CAP 100nF 25V 0603(1608)  [CAPC0603(1608)100_N]
C47  CAP 100nF 25V 0603(1608)  [CAPC0603(1608)100_N]
R31  Bourns 3224  value 50R  [BOURNS 3224W]
R32  Bourns 3224  value 50R  [BOURNS 3224W]
R33  4R7 1% 0603(1608)  [RESC0603(1608)_M]
R34  0603 Res  value 64.2k  [J1-0603]
R35  750R 1% 0603(1608)  [RESC0603(1608)_L]
R36  Bourns 3224  value 5K  [BOURNS 3224W]
R37  0603 Res  value 62k  [J1-0603]
R38  3313J-1-203E  [BOUR-3313J-1_V]
R39  4R7 1% 0603(1608)  [RESC0603(1608)_M]
R40  0603 Res  value 1k  [J1-0603]
R41  20R 1% 0603(1608)  [RESC0603(1608)_M]
U16  R1-R4 1k, R2-R3 10k Ohms  [0612 (4x0603)]
U17  OPA211AIDR  [TI-D8_L]  (parts A,B of 2)
U18  AD844ANZ  [ADI-N-8]
U19  OPA211AIDR  [TI-D8_L]  (parts A,B of 2)

### Nets
GND: C39.1 C40.1 C41.1 C43.1 C44.2 C45.2 C46.1 C47.1 R31.2(TAP) R36.2(TAP) U17.1(NC) U17.5(NC) U17.8(NC) U19.1(NC) U19.5(NC) U19.8(NC)
Current_Ch3_OUT: R41.1 U19.3(IN+)
DAC_Ch3_OUT: R32.2(TAP)
N15VREF: R34.2
Neg_FB_3: U16.8(R1-R) U19.2(IN-) U19.6(OUT)
Pos_FB_3: C42.2 R40.1 R41.2 U16.5(R4-R) U18.6(OUTPUT)
VDD18: C41.2 C47.2 R39.1 U17.7(V+) U19.7(V+)
VSS18: C43.2 C46.2 R33.2 U17.4(V-) U19.4(V-)
NetC39_2: C39.2 C40.2 R33.1 U18.4(-VS)
NetC42_1: C42.1 R35.2
NetC44_1: C44.1 C45.1 R38.2 R39.2 U18.7(+VS)
NetR31_3: R31.3(BOT) U16.7(R2-R)
NetR32_1: R32.1(TOP) U16.6(R3-R)
NetR34_1: R34.1 U16.3(R3-L) U16.4(R4-L) U17.2(IN-)
NetR35_1: R35.1 U18.5(TZ)
NetR36_1: R36.1(TOP) R37.2
NetR37_1: R37.1 U16.1(R1-L) U16.2(R2-L) U17.3(IN+)
NetR38_1: R38.1 U18.8(NULL)
NetR38_3: R38.3 U18.1(NULL)
NetR40_2: R40.2 U18.2(-IN)
NetU17_6: U17.6(OUT) U18.3(+IN)

Not connected (* = marked no-connect by the designer): R31 1(TOP)*; R32 3(BOT)*; R36 3(BOT)*

### Library data of the parts
C39 C45 = CMP-1036-04932-1: as C58 on sheet Power Supply; Technology: SMT; Value: 10uF; Rated Voltage: 25 V; Max Thickness: 1.45 mm
C40 C44 = CMP-2000-05394-1: as C22 on sheet Howland Channel 1; Ratings: -; Lead Spacing: -; Package Description: 2-Pin Chip Capacitor, Body 1.7 x 0.9 mm; Datasheet URL: https://datasheet.ciiva.com/24218/c1608x7r1h224k080ab-264841-24218813.pdf; Applications: GeneralPurpose; Series: C; Manufacturer URL: http://www.tdk.com/; Features: -; Tolerance: ±10%; Package Reference: 603; Family: CeramicCapacitors; Standard Package: 1; RoHS Information: RoHSCertificate-MLCC; Package / Case: 0603(1608Metric); Operating Temperature: -55degC~125degC; Datasheet Version: Sep-13; Mounting Type: SurfaceMount,MLCC; Lead Style: -; Height - Seated (Max): -; Packaging: CutTape(CT); Category: Capacitors
C41 C43 C46 C47 = CMP-1035-02589-1: as C1 on sheet Digital Interfaces; Value: 100nF; Max Thickness: 1 mm; Technology: SMT; Rated Voltage: 25 V
C42 = CMP-1035-00820-1: as C24 on sheet Howland Channel 1; Rated Voltage: 50 V; Value: 22pF; Technology: SMT; Max Thickness: 1 mm
R31 R32 R36 = 3224-Series Trimmer Potentiometer: as R64 on sheet Digital Interfaces; Published: 8-Jun-2000; LatestRevisionDate: 17-Jul-2002; LatestRevisionNote: Re-released for DXP Platform.; PackageReference: VR5; Publisher: Altium Limited; PackageDescription: Variable Resistor, Thru-Hole; 3 Leads
R33 R39 = CMP-1012-00247-1: as R11 on sheet Howland Channel 1; Power: 0.1 W; Technology: SMT; Tolerance: 1 %
R34 R37 R40 = Res1: Chip Resistor, 0603, 1%; Published: 8-Jun-2000; LatestRevisionDate: 17-Jul-2002; LatestRevisionNote: Re-released for DXP Platform.; PackageReference: AXIAL-0.3; Publisher: Altium Limited; PackageDescription: Axial Device, Thru-Hole; 2 Leads; 0.3 in Pin Spacing
R35 = CMP-1012-00496-1: as R13 on sheet Howland Channel 1; Technology: SMT; Tolerance: 1 %; Power: 0.1 W
R38 = CMP-2000-05586-1: as R16 on sheet Howland Channel 1; Package Reference: 3313J-1; Tolerance: ±20%; Type: Trimmer; Package Description: 3-Pin Surface Mount Device, Body 3.5 x 3.2 mm, Pitch 1.15 mm; Mounting Technology: SurfaceMount; Datasheet URL: http://www.bourns.com/docs/Product-Datasheets/3313.pdf; Mounting Type: SurfaceMount; Manufacturer URL: http://www.bourns.com/; Datasheet Version: 05/2016; Termination: SMD
R41 = CMP-1012-00316-1: as R19 on sheet Howland Channel 1; Technology: SMT; Tolerance: 1 %; Power: 0.1 W
U16 = VISHAY ACAS: as U8 on sheet Howland Channel 1
U17 U19 = CMP-0272-00537-2: as U9 on sheet Howland Channel 1; Eco-Plan: Green (RoHS & no Sb/Br); DatasheetVersion: SBOS377G; Iq per channel(Max)(mA): 4.5; ComponentLink2URL: http://www.ti.com/lit/ds/symlink/opa211.pdf; ComponentLink1Description: Manufacturer URL; ComponentLink3Description: Package Specification; Code_JEDEC: MS-012; ComponentLink3URL: http://www.ti.com/litv/pdf/msoi002j; PartNumber: OPA211AIDR; ComponentLink2Description: Datasheet; PackageReference: D8; PackageVersion: 4040047-3/M, 06/2011; ComponentLink1URL: http://www.ti.com/; Mounting Technology: Surface Mount; PackageDescription: 8-Pin Plastic Small Outline, Body 4.9 x 3.9 mm, Pitch 1.27 mm; PartId: 1
U18 = CMP-0384-00240-1: as U10 on sheet Howland Channel 1; Code_JEDEC: MS-001; PackageDescription: 8-Pin Plastic Dual In-Line Package, Row spacing 7.62 mm, Pitch 2.54 mm; DatasheetVersion: Rev. F; ComponentLink2URL: http://www.analog.com/static/imported-files/data_sheets/AD844.pdf; PackageReference: N-8; ComponentLink2Description: Datasheet; PartNumber: AD844ANZ; ComponentLink1URL: http://www.analog.com/en/index.html; ComponentLink3Description: Package Specification; Mounting Technology: Through Hole; ComponentLink3URL: http:/www.analog.com/static/imported-files/packages/PKG_PDF/PDIP(N)/N_8.pdf; ComponentLink1Description: Manufacturer URL; PackageVersion: 070606-A; Packing: Tube

## Sheet Howland Channel 4.SchDoc
size A4
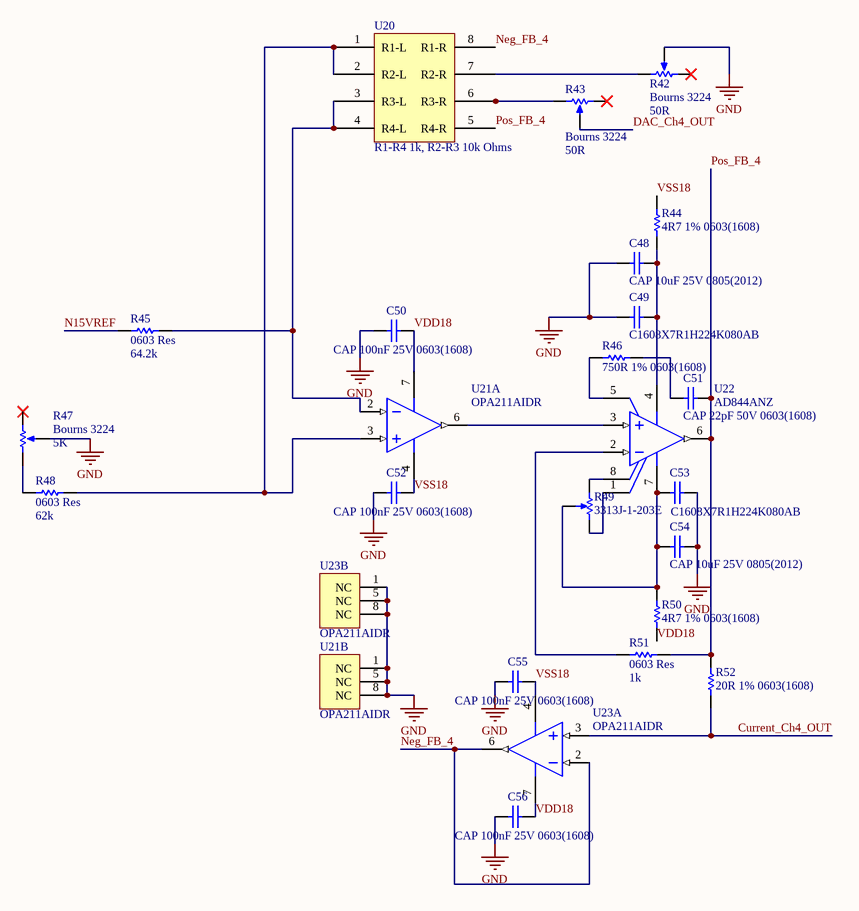
[diagram p5: Howland Channel 4.SchDoc]

### Parts
C48  CAP 10uF 25V 0805(2012)  [CAPC0805(2012)145_N]
C49  C1608X7R1H224K080AB  [TDK-C1608-2_A_M]
C50  CAP 100nF 25V 0603(1608)  [CAPC0603(1608)100_N]
C51  CAP 22pF 50V 0603(1608)  [CAPC0603(1608)100_M]
C52  CAP 100nF 25V 0603(1608)  [CAPC0603(1608)100_N]
C53  C1608X7R1H224K080AB  [TDK-C1608-2_A_M]
C54  CAP 10uF 25V 0805(2012)  [CAPC0805(2012)145_N]
C55  CAP 100nF 25V 0603(1608)  [CAPC0603(1608)100_N]
C56  CAP 100nF 25V 0603(1608)  [CAPC0603(1608)100_N]
R42  Bourns 3224  value 50R  [BOURNS 3224W]
R43  Bourns 3224  value 50R  [BOURNS 3224W]
R44  4R7 1% 0603(1608)  [RESC0603(1608)_M]
R45  0603 Res  value 64.2k  [J1-0603]
R46  750R 1% 0603(1608)  [RESC0603(1608)_L]
R47  Bourns 3224  value 5K  [BOURNS 3224W]
R48  0603 Res  value 62k  [J1-0603]
R49  3313J-1-203E  [BOUR-3313J-1_V]
R50  4R7 1% 0603(1608)  [RESC0603(1608)_M]
R51  0603 Res  value 1k  [J1-0603]
R52  20R 1% 0603(1608)  [RESC0603(1608)_M]
U20  R1-R4 1k, R2-R3 10k Ohms  [0612 (4x0603)]
U21  OPA211AIDR  [TI-D8_L]  (parts A,B of 2)
U22  AD844ANZ  [ADI-N-8]
U23  OPA211AIDR  [TI-D8_L]  (parts A,B of 2)

### Nets
GND: C48.1 C49.1 C50.1 C52.1 C53.2 C54.2 C55.1 C56.1 R42.2(TAP) R47.2(TAP) U21.1(NC) U21.5(NC) U21.8(NC) U23.1(NC) U23.5(NC) U23.8(NC)
Current_Ch4_OUT: R52.1 U23.3(IN+)
DAC_Ch4_OUT: R43.2(TAP)
N15VREF: R45.2
Neg_FB_4: U20.8(R1-R) U23.2(IN-) U23.6(OUT)
Pos_FB_4: C51.2 R51.1 R52.2 U20.5(R4-R) U22.6(OUTPUT)
VDD18: C50.2 C56.2 R50.1 U21.7(V+) U23.7(V+)
VSS18: C52.2 C55.2 R44.2 U21.4(V-) U23.4(V-)
NetC48_2: C48.2 C49.2 R44.1 U22.4(-VS)
NetC51_1: C51.1 R46.2
NetC53_1: C53.1 C54.1 R49.2 R50.2 U22.7(+VS)
NetR42_3: R42.3(BOT) U20.7(R2-R)
NetR43_1: R43.1(TOP) U20.6(R3-R)
NetR45_1: R45.1 U20.3(R3-L) U20.4(R4-L) U21.2(IN-)
NetR46_1: R46.1 U22.5(TZ)
NetR47_1: R47.1(TOP) R48.2
NetR48_1: R48.1 U20.1(R1-L) U20.2(R2-L) U21.3(IN+)
NetR49_1: R49.1 U22.8(NULL)
NetR49_3: R49.3 U22.1(NULL)
NetR51_2: R51.2 U22.2(-IN)
NetU21_6: U21.6(OUT) U22.3(+IN)

Not connected (* = marked no-connect by the designer): R42 1(TOP)*; R43 3(BOT)*; R47 3(BOT)*

### Library data of the parts
C48 C54 = CMP-1036-04932-1: as C58 on sheet Power Supply; Technology: SMT; Value: 10uF; Rated Voltage: 25 V; Max Thickness: 1.45 mm
C49 C53 = CMP-2000-05394-1: as C22 on sheet Howland Channel 1; Ratings: -; Lead Spacing: -; Package Description: 2-Pin Chip Capacitor, Body 1.7 x 0.9 mm; Datasheet URL: https://datasheet.ciiva.com/24218/c1608x7r1h224k080ab-264841-24218813.pdf; Applications: GeneralPurpose; Series: C; Manufacturer URL: http://www.tdk.com/; Features: -; Tolerance: ±10%; Package Reference: 603; Family: CeramicCapacitors; Standard Package: 1; RoHS Information: RoHSCertificate-MLCC; Package / Case: 0603(1608Metric); Operating Temperature: -55degC~125degC; Datasheet Version: Sep-13; Mounting Type: SurfaceMount,MLCC; Lead Style: -; Height - Seated (Max): -; Packaging: CutTape(CT); Category: Capacitors
C50 C52 C55 C56 = CMP-1035-02589-1: as C1 on sheet Digital Interfaces; Value: 100nF; Max Thickness: 1 mm; Technology: SMT; Rated Voltage: 25 V
C51 = CMP-1035-00820-1: as C24 on sheet Howland Channel 1; Rated Voltage: 50 V; Value: 22pF; Technology: SMT; Max Thickness: 1 mm
R42 R43 R47 = 3224-Series Trimmer Potentiometer: as R64 on sheet Digital Interfaces; Published: 8-Jun-2000; LatestRevisionDate: 17-Jul-2002; LatestRevisionNote: Re-released for DXP Platform.; PackageReference: VR5; Publisher: Altium Limited; PackageDescription: Variable Resistor, Thru-Hole; 3 Leads
R44 R50 = CMP-1012-00247-1: as R11 on sheet Howland Channel 1; Power: 0.1 W; Technology: SMT; Tolerance: 1 %
R45 R48 R51 = Res1: Chip Resistor, 0603, 1%; Published: 8-Jun-2000; LatestRevisionDate: 17-Jul-2002; LatestRevisionNote: Re-released for DXP Platform.; PackageReference: AXIAL-0.3; Publisher: Altium Limited; PackageDescription: Axial Device, Thru-Hole; 2 Leads; 0.3 in Pin Spacing
R46 = CMP-1012-00496-1: as R13 on sheet Howland Channel 1; Technology: SMT; Tolerance: 1 %; Power: 0.1 W
R49 = CMP-2000-05586-1: as R16 on sheet Howland Channel 1; Package Reference: 3313J-1; Tolerance: ±20%; Type: Trimmer; Package Description: 3-Pin Surface Mount Device, Body 3.5 x 3.2 mm, Pitch 1.15 mm; Mounting Technology: SurfaceMount; Datasheet URL: http://www.bourns.com/docs/Product-Datasheets/3313.pdf; Mounting Type: SurfaceMount; Manufacturer URL: http://www.bourns.com/; Datasheet Version: 05/2016; Termination: SMD
R52 = CMP-1012-00316-1: as R19 on sheet Howland Channel 1; Technology: SMT; Tolerance: 1 %; Power: 0.1 W
U20 = VISHAY ACAS: as U8 on sheet Howland Channel 1
U21 U23 = CMP-0272-00537-2: as U9 on sheet Howland Channel 1; Eco-Plan: Green (RoHS & no Sb/Br); DatasheetVersion: SBOS377G; Iq per channel(Max)(mA): 4.5; ComponentLink2URL: http://www.ti.com/lit/ds/symlink/opa211.pdf; ComponentLink1Description: Manufacturer URL; ComponentLink3Description: Package Specification; Code_JEDEC: MS-012; ComponentLink3URL: http://www.ti.com/litv/pdf/msoi002j; PartNumber: OPA211AIDR; ComponentLink2Description: Datasheet; PackageReference: D8; PackageVersion: 4040047-3/M, 06/2011; ComponentLink1URL: http://www.ti.com/; Mounting Technology: Surface Mount; PackageDescription: 8-Pin Plastic Small Outline, Body 4.9 x 3.9 mm, Pitch 1.27 mm; PartId: 1
U22 = CMP-0384-00240-1: as U10 on sheet Howland Channel 1; Code_JEDEC: MS-001; PackageDescription: 8-Pin Plastic Dual In-Line Package, Row spacing 7.62 mm, Pitch 2.54 mm; DatasheetVersion: Rev. F; ComponentLink2URL: http://www.analog.com/static/imported-files/data_sheets/AD844.pdf; PackageReference: N-8; ComponentLink2Description: Datasheet; PartNumber: AD844ANZ; ComponentLink1URL: http://www.analog.com/en/index.html; ComponentLink3Description: Package Specification; Mounting Technology: Through Hole; ComponentLink3URL: http:/www.analog.com/static/imported-files/packages/PKG_PDF/PDIP(N)/N_8.pdf; ComponentLink1Description: Manufacturer URL; PackageVersion: 070606-A; Packing: Tube